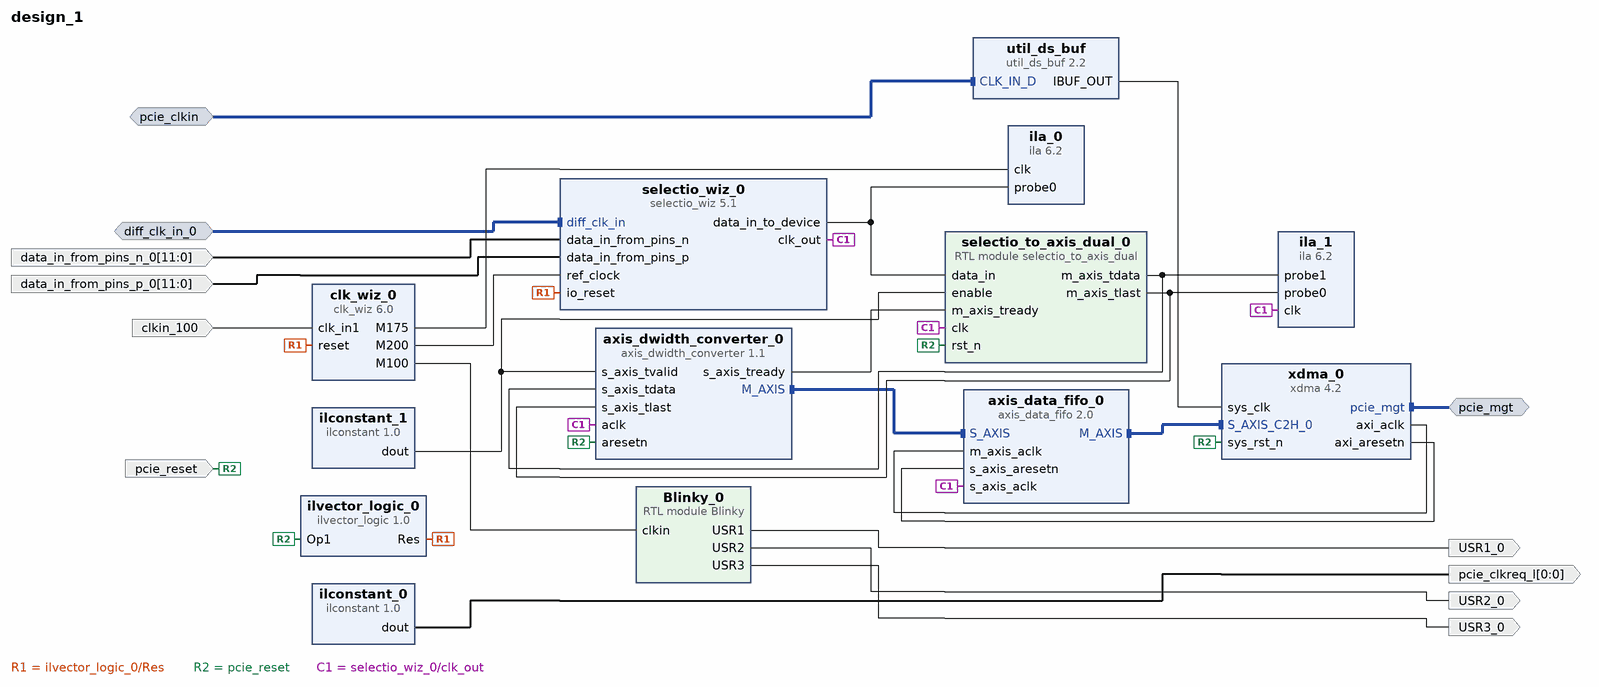
[diagram p0: block diagram of the top level]
# Vivado block design design_1, xc7a100tfgg484-2, Vivado 2025.2
create_bd_design design_1

create_bd_intf_port -mode Master -vlnv xilinx.com:interface:pcie_7x_mgt_rtl:1.0 pcie_mgt
create_bd_intf_port -mode Slave -vlnv xilinx.com:interface:diff_clock_rtl:1.0 pcie_clkin
set_property -dict {CONFIG.FREQ_HZ 100000000} [get_bd_intf_ports pcie_clkin]
create_bd_intf_port -mode Slave -vlnv xilinx.com:interface:diff_clock_rtl:1.0 diff_clk_in_0
create_bd_port -dir I -type clk clkin_100
create_bd_port -dir O USR1_0
create_bd_port -dir O USR2_0
create_bd_port -dir O USR3_0
create_bd_port -dir I -type rst pcie_reset
set_property -dict {CONFIG.POLARITY ACTIVE_LOW} [get_bd_ports pcie_reset]
create_bd_port -dir O -from 0 -to 0 pcie_clkreq_l
create_bd_port -dir I -from 11 -to 0 data_in_from_pins_p_0
create_bd_port -dir I -from 11 -to 0 data_in_from_pins_n_0

create_bd_cell -type module -reference Blinky Blinky_0
create_bd_cell -type ip -vlnv xilinx.com:ip:xdma:4.2 xdma_0
set_property -dict [list \
  CONFIG.axi_data_width 64_bit \
  CONFIG.axisten_freq 125 \
  CONFIG.pl_link_cap_max_link_speed 5.0_GT/s \
  CONFIG.xdma_axi_intf_mm AXI_Stream \
] [get_bd_cells xdma_0]
create_bd_cell -type ip -vlnv xilinx.com:ip:util_ds_buf:2.2 util_ds_buf
set_property -dict {CONFIG.C_BUF_TYPE IBUFDSGTE} [get_bd_cells util_ds_buf]
create_bd_cell -type ip -vlnv xilinx.com:ip:axis_data_fifo:2.0 axis_data_fifo_0
set_property -dict {CONFIG.FIFO_DEPTH 8192 CONFIG.IS_ACLK_ASYNC 1 CONFIG.TDATA_NUM_BYTES 8} [get_bd_cells axis_data_fifo_0]
create_bd_cell -type inline_hdl -vlnv xilinx.com:inline_hdl:ilconstant:1.0 ilconstant_0
set_property -dict {CONFIG.CONST_VAL 0} [get_bd_cells ilconstant_0]
create_bd_cell -type ip -vlnv xilinx.com:ip:selectio_wiz:5.1 selectio_wiz_0
set_property -dict [list \
  CONFIG.BUS_IO_STD LVDS_25 \
  CONFIG.BUS_SIG_TYPE DIFF \
  CONFIG.CLK_FWD_IO_STD LVDS_25 \
  CONFIG.CLK_FWD_SIG_TYPE DIFF \
  CONFIG.SELIO_ACTIVE_EDGE DDR \
  CONFIG.SELIO_BUS_IN_DELAY FIXED \
  CONFIG.SELIO_CLK_IO_STD LVDS_25 \
  CONFIG.SELIO_CLK_SIG_TYPE DIFF \
  CONFIG.SELIO_INTERFACE_TYPE NETWORKING \
  CONFIG.SERIALIZATION_FACTOR 4 \
  CONFIG.SYSTEM_DATA_WIDTH 12 \
] [get_bd_cells selectio_wiz_0]
create_bd_cell -type ip -vlnv xilinx.com:ip:clk_wiz:6.0 clk_wiz_0
set_property -dict [list \
  CONFIG.CLKIN2_JITTER_PS 166.66 \
  CONFIG.CLKOUT1_JITTER 102.665 \
  CONFIG.CLKOUT1_PHASE_ERROR 79.592 \
  CONFIG.CLKOUT1_USED true \
  CONFIG.CLKOUT2_JITTER 90.666 \
  CONFIG.CLKOUT2_PHASE_ERROR 79.592 \
  CONFIG.CLKOUT2_REQUESTED_OUT_FREQ 200 \
  CONFIG.CLKOUT2_USED true \
  CONFIG.CLKOUT3_JITTER 92.855 \
  CONFIG.CLKOUT3_PHASE_ERROR 79.592 \
  CONFIG.CLKOUT3_REQUESTED_OUT_FREQ 175 \
  CONFIG.CLKOUT3_USED true \
  CONFIG.CLK_OUT1_PORT M100 \
  CONFIG.CLK_OUT2_PORT M200 \
  CONFIG.CLK_OUT3_PORT M175 \
  CONFIG.MMCM_CLKFBOUT_MULT_F 14.000 \
  CONFIG.MMCM_CLKIN2_PERIOD 10.000 \
  CONFIG.MMCM_CLKOUT0_DIVIDE_F 14.000 \
  CONFIG.MMCM_CLKOUT1_DIVIDE 7 \
  CONFIG.MMCM_CLKOUT2_DIVIDE 8 \
  CONFIG.NUM_OUT_CLKS 3 \
  CONFIG.SECONDARY_SOURCE Single_ended_clock_capable_pin \
  CONFIG.USE_INCLK_SWITCHOVER false \
] [get_bd_cells clk_wiz_0]
create_bd_cell -type inline_hdl -vlnv xilinx.com:inline_hdl:ilvector_logic:1.0 ilvector_logic_0
set_property -dict {CONFIG.C_OPERATION not CONFIG.C_SIZE 1} [get_bd_cells ilvector_logic_0]
create_bd_cell -type ip -vlnv xilinx.com:ip:axis_dwidth_converter:1.1 axis_dwidth_converter_0
set_property -dict {CONFIG.M_TDATA_NUM_BYTES 8 CONFIG.S_TDATA_NUM_BYTES 3} [get_bd_cells axis_dwidth_converter_0]
create_bd_cell -type inline_hdl -vlnv xilinx.com:inline_hdl:ilconstant:1.0 ilconstant_1
create_bd_cell -type ip -vlnv xilinx.com:ip:ila:6.2 ila_0
set_property -dict [list \
  CONFIG.C_DATA_DEPTH 8192 \
  CONFIG.C_MONITOR_TYPE Native \
  CONFIG.C_NUM_OF_PROBES 1 \
  CONFIG.C_PROBE0_WIDTH 24 \
] [get_bd_cells ila_0]
create_bd_cell -type ip -vlnv xilinx.com:ip:ila:6.2 ila_1
set_property -dict [list \
  CONFIG.C_MONITOR_TYPE Native \
  CONFIG.C_NUM_OF_PROBES 2 \
  CONFIG.C_PROBE0_WIDTH 4 \
  CONFIG.C_PROBE1_WIDTH 32 \
] [get_bd_cells ila_1]
create_bd_cell -type module -reference selectio_to_axis_dual selectio_to_axis_dual_0

# ---- connections ----

connect_bd_intf_net [get_bd_intf_pins axis_data_fifo_0/M_AXIS] [get_bd_intf_pins xdma_0/S_AXIS_C2H_0]
connect_bd_intf_net [get_bd_intf_pins axis_dwidth_converter_0/M_AXIS] [get_bd_intf_pins axis_data_fifo_0/S_AXIS]
connect_bd_intf_net -intf_net diff_clk_in_0_1 [get_bd_intf_ports diff_clk_in_0] [get_bd_intf_pins selectio_wiz_0/diff_clk_in]
connect_bd_intf_net -intf_net diff_clock_rtl_0_1 [get_bd_intf_ports pcie_clkin] [get_bd_intf_pins util_ds_buf/CLK_IN_D]
connect_bd_intf_net [get_bd_intf_ports pcie_mgt] [get_bd_intf_pins xdma_0/pcie_mgt]
connect_bd_net [get_bd_pins Blinky_0/USR1] [get_bd_ports USR1_0]
connect_bd_net [get_bd_pins Blinky_0/USR2] [get_bd_ports USR2_0]
connect_bd_net [get_bd_pins Blinky_0/USR3] [get_bd_ports USR3_0]
connect_bd_net [get_bd_pins axis_dwidth_converter_0/s_axis_tready] [get_bd_pins selectio_to_axis_dual_0/m_axis_tready]
connect_bd_net [get_bd_pins clk_wiz_0/M100] [get_bd_pins Blinky_0/clkin]
connect_bd_net [get_bd_pins clk_wiz_0/M175] [get_bd_pins ila_0/clk]
connect_bd_net [get_bd_pins clk_wiz_0/M200] [get_bd_pins selectio_wiz_0/ref_clock]
connect_bd_net -net clkin_100_1 [get_bd_ports clkin_100] [get_bd_pins clk_wiz_0/clk_in1]
connect_bd_net -net data_in_from_pins_n_0_1 [get_bd_ports data_in_from_pins_n_0] [get_bd_pins selectio_wiz_0/data_in_from_pins_n]
connect_bd_net -net data_in_from_pins_p_0_1 [get_bd_ports data_in_from_pins_p_0] [get_bd_pins selectio_wiz_0/data_in_from_pins_p]
connect_bd_net [get_bd_pins ilconstant_0/dout] [get_bd_ports pcie_clkreq_l]
connect_bd_net [get_bd_pins ilconstant_1/dout] [get_bd_pins axis_dwidth_converter_0/s_axis_tvalid] [get_bd_pins selectio_to_axis_dual_0/enable]
connect_bd_net [get_bd_pins ilvector_logic_0/Res] [get_bd_pins clk_wiz_0/reset] [get_bd_pins selectio_wiz_0/io_reset]
connect_bd_net -net reset_rtl_0_1 [get_bd_ports pcie_reset] \
  [get_bd_pins xdma_0/sys_rst_n] [get_bd_pins ilvector_logic_0/Op1] [get_bd_pins axis_dwidth_converter_0/aresetn] \
  [get_bd_pins selectio_to_axis_dual_0/rst_n]
connect_bd_net -net selectio_to_axis_0_m_axis_tdata [get_bd_pins selectio_to_axis_dual_0/m_axis_tdata] \
  [get_bd_pins ila_1/probe1] [get_bd_pins axis_dwidth_converter_0/s_axis_tdata]
connect_bd_net -net selectio_to_axis_0_m_axis_tlast [get_bd_pins selectio_to_axis_dual_0/m_axis_tlast] \
  [get_bd_pins ila_1/probe0] [get_bd_pins axis_dwidth_converter_0/s_axis_tlast]
connect_bd_net [get_bd_pins selectio_wiz_0/clk_out] \
  [get_bd_pins axis_data_fifo_0/s_axis_aclk] [get_bd_pins axis_dwidth_converter_0/aclk] [get_bd_pins ila_1/clk] \
  [get_bd_pins selectio_to_axis_dual_0/clk]
connect_bd_net [get_bd_pins selectio_wiz_0/data_in_to_device] [get_bd_pins ila_0/probe0] [get_bd_pins selectio_to_axis_dual_0/data_in]
connect_bd_net [get_bd_pins util_ds_buf/IBUF_OUT] [get_bd_pins xdma_0/sys_clk]
connect_bd_net [get_bd_pins xdma_0/axi_aclk] [get_bd_pins axis_data_fifo_0/m_axis_aclk]
connect_bd_net [get_bd_pins xdma_0/axi_aresetn] [get_bd_pins axis_data_fifo_0/s_axis_aresetn]

validate_bd_design
save_bd_design
